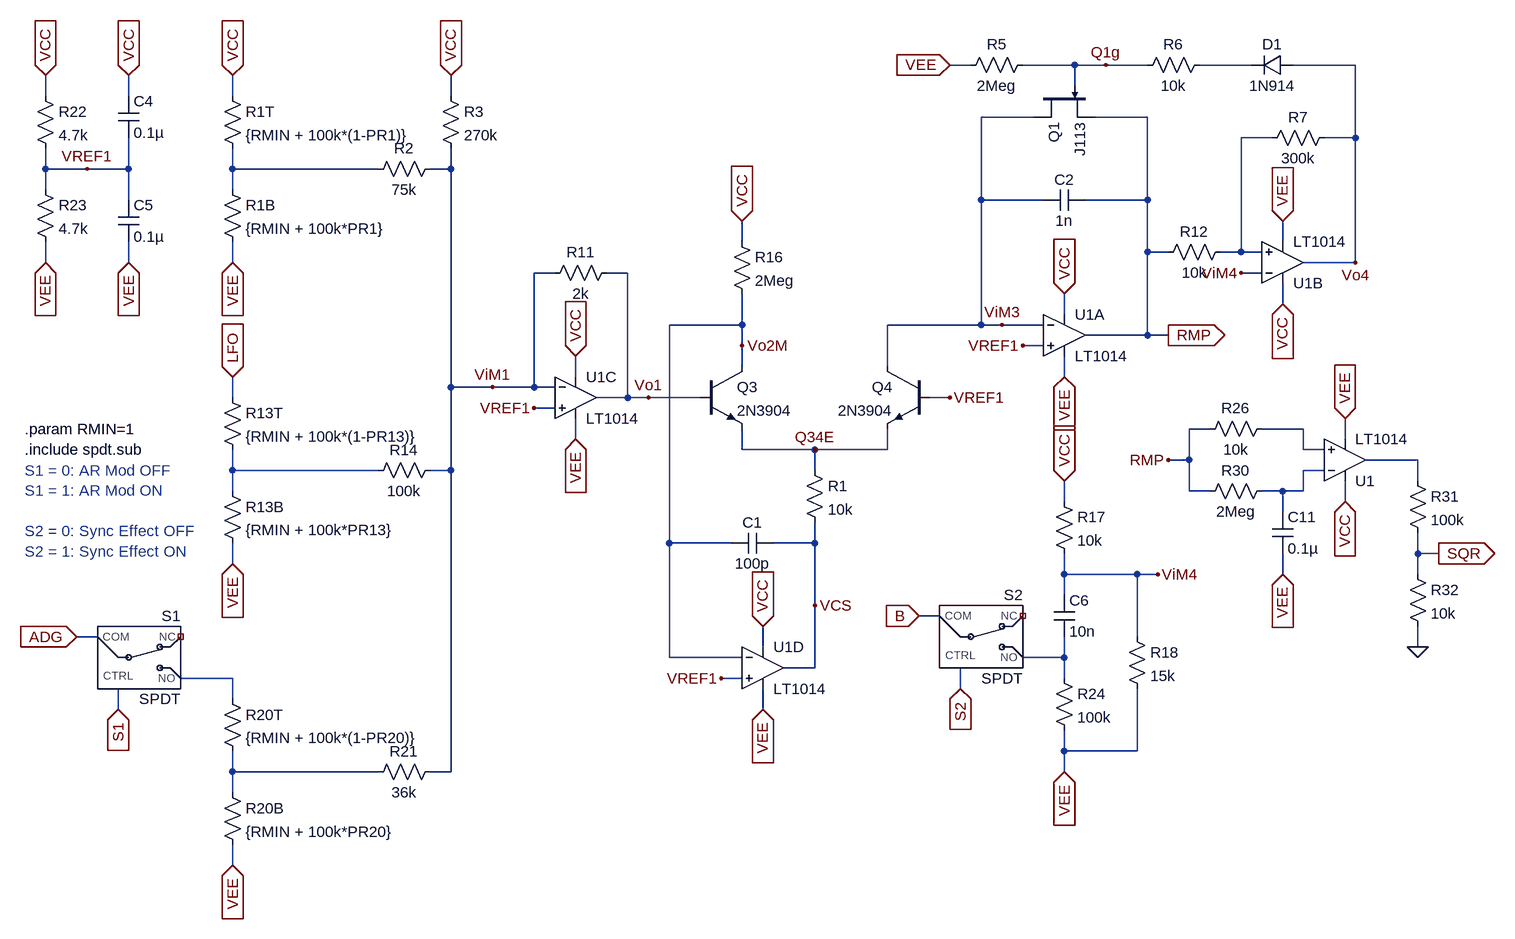
[diagram p0: schematic VCO.asc]
VCO.asc, the LTspice schematic file:
Version 4.1
SHEET 1 2252 1144
WIRE 1248 -336 1216 -336
WIRE 1408 -336 1328 -336
WIRE 1456 -336 1408 -336
WIRE 1520 -336 1456 -336
WIRE 1680 -336 1600 -336
WIRE 1840 -336 1744 -336
WIRE 1408 -304 1408 -336
WIRE -176 -288 -176 -320
WIRE -48 -288 -48 -320
WIRE 112 -288 112 -320
WIRE 448 -288 448 -320
WIRE 1344 -256 1264 -256
WIRE 1520 -256 1440 -256
WIRE 1712 -224 1664 -224
WIRE 1840 -224 1840 -336
WIRE 1840 -224 1792 -224
WIRE -176 -176 -176 -208
WIRE -112 -176 -176 -176
WIRE -48 -176 -48 -224
WIRE -48 -176 -112 -176
WIRE 112 -176 112 -208
WIRE 336 -176 112 -176
WIRE 448 -176 448 -208
WIRE 448 -176 416 -176
WIRE -176 -144 -176 -176
WIRE 112 -144 112 -176
WIRE -48 -128 -48 -176
WIRE 1264 -128 1264 -256
WIRE 1360 -128 1264 -128
WIRE 1520 -128 1520 -256
WIRE 1520 -128 1424 -128
WIRE 896 -64 896 -96
WIRE 1728 -64 1728 -96
WIRE 1520 -48 1520 -128
WIRE 1552 -48 1520 -48
WIRE 1664 -48 1664 -224
WIRE 1664 -48 1632 -48
WIRE 1696 -48 1664 -48
WIRE -176 -32 -176 -64
WIRE -48 -32 -48 -64
WIRE 112 -32 112 -64
WIRE 1840 -32 1840 -224
WIRE 1840 -32 1760 -32
WIRE 608 -16 576 -16
WIRE 720 -16 688 -16
WIRE 1696 -16 1664 -16
WIRE 1728 32 1728 0
WIRE 1392 48 1392 16
WIRE 896 64 896 16
WIRE 896 64 784 64
WIRE 1264 64 1264 -128
WIRE 1264 64 1120 64
WIRE 1296 64 1264 64
WIRE 1360 64 1296 64
WIRE 1520 80 1520 -48
WIRE 1520 80 1424 80
WIRE 1552 80 1520 80
WIRE 896 96 896 64
WIRE 1360 96 1328 96
WIRE 896 128 896 96
WIRE 1120 128 1120 64
WIRE 640 144 640 112
WIRE 1392 144 1392 112
WIRE 448 160 448 -176
WIRE 512 160 448 160
WIRE 576 160 576 -16
WIRE 576 160 512 160
WIRE 608 160 576 160
WIRE 112 176 112 144
WIRE 720 176 720 -16
WIRE 720 176 672 176
WIRE 752 176 720 176
WIRE 832 176 752 176
WIRE 1216 176 1184 176
WIRE 608 192 576 192
WIRE 1616 224 1584 224
WIRE 1760 224 1696 224
WIRE 640 240 640 208
WIRE 1824 240 1824 208
WIRE 896 256 896 224
WIRE 1008 256 896 256
WIRE 1120 256 1120 224
WIRE 1120 256 1008 256
WIRE 1760 256 1760 224
WIRE 1792 256 1760 256
WIRE 1584 272 1584 224
WIRE 1584 272 1552 272
WIRE 1936 272 1856 272
WIRE 112 288 112 256
WIRE 336 288 112 288
WIRE 448 288 448 160
WIRE 448 288 416 288
WIRE 1008 288 1008 256
WIRE 1792 288 1760 288
WIRE 1936 304 1936 272
WIRE 112 320 112 288
WIRE 1584 320 1584 272
WIRE 1616 320 1584 320
WIRE 1728 320 1696 320
WIRE 1760 320 1760 288
WIRE 1760 320 1728 320
WIRE 1392 336 1392 304
WIRE 1824 336 1824 304
WIRE 1728 352 1728 320
WIRE 784 400 784 64
WIRE 880 400 784 400
WIRE 1008 400 1008 368
WIRE 1008 400 944 400
WIRE 1936 416 1936 384
WIRE 1968 416 1936 416
WIRE 112 432 112 400
WIRE 1392 448 1392 416
WIRE 1504 448 1392 448
WIRE 1536 448 1504 448
WIRE 1728 448 1728 416
WIRE 1936 448 1936 416
WIRE 1392 480 1392 448
WIRE 1008 496 1008 400
WIRE 1200 512 1168 512
WIRE -96 544 -128 544
WIRE 1504 544 1504 448
WIRE 928 560 928 528
WIRE 1936 560 1936 528
WIRE 784 576 784 400
WIRE 896 576 784 576
WIRE 1392 576 1392 544
WIRE 1392 576 1328 576
WIRE 1008 592 1008 496
WIRE 1008 592 960 592
WIRE 112 608 32 608
WIRE 896 608 864 608
WIRE 1392 608 1392 576
WIRE 1232 624 1232 592
WIRE 112 640 112 608
WIRE -64 656 -64 624
WIRE 928 656 928 624
WIRE 1392 720 1392 688
WIRE 1504 720 1504 624
WIRE 1504 720 1392 720
WIRE 112 752 112 720
WIRE 336 752 112 752
WIRE 448 752 448 288
WIRE 448 752 416 752
WIRE 1392 752 1392 720
WIRE 112 784 112 752
WIRE 112 896 112 864
FLAG 112 -32 VEE
IOPIN 112 -32 In
FLAG 112 -320 VCC
IOPIN 112 -320 In
FLAG 112 432 VEE
IOPIN 112 432 In
FLAG 112 144 LFO
IOPIN 112 144 In
FLAG 112 896 VEE
IOPIN 112 896 In
FLAG -128 544 ADG
IOPIN -128 544 In
FLAG -64 656 S1
IOPIN -64 656 In
FLAG 640 112 VCC
IOPIN 640 112 In
FLAG 640 240 VEE
IOPIN 640 240 In
FLAG 448 -320 VCC
IOPIN 448 -320 In
FLAG 576 192 VREF1
FLAG 896 -96 VCC
IOPIN 896 -96 In
FLAG 928 528 VCC
IOPIN 928 528 In
FLAG 928 656 VEE
IOPIN 928 656 In
FLAG 864 608 VREF1
FLAG 1216 176 VREF1
FLAG 1392 16 VCC
IOPIN 1392 16 In
FLAG 1392 144 VEE
IOPIN 1392 144 In
FLAG 1328 96 VREF1
FLAG 1216 -336 VEE
IOPIN 1216 -336 In
FLAG 1728 -96 VEE
IOPIN 1728 -96 In
FLAG 1728 32 VCC
IOPIN 1728 32 In
FLAG 1552 80 RMP
IOPIN 1552 80 Out
FLAG 1392 752 VEE
IOPIN 1392 752 In
FLAG 1392 304 VCC
IOPIN 1392 304 In
FLAG 1168 512 B
IOPIN 1168 512 In
FLAG 1232 624 S2
IOPIN 1232 624 In
FLAG 1824 208 VEE
IOPIN 1824 208 In
FLAG 1824 336 VCC
IOPIN 1824 336 In
FLAG 1728 448 VEE
IOPIN 1728 448 In
FLAG 1936 560 0
FLAG 1968 416 SQR
IOPIN 1968 416 Out
FLAG 1664 -16 ViM4
FLAG 1536 448 ViM4
FLAG 1552 272 RMP
FLAG 752 176 Vo1
FLAG 1296 64 ViM3
FLAG -176 -32 VEE
IOPIN -176 -32 In
FLAG -176 -320 VCC
IOPIN -176 -320 In
FLAG -48 -32 VEE
IOPIN -48 -32 In
FLAG -48 -320 VCC
IOPIN -48 -320 In
FLAG -112 -176 VREF1
FLAG 1840 -32 Vo4
FLAG 1456 -336 Q1g
FLAG 896 96 Vo2M
FLAG 1008 256 Q34E
FLAG 1008 496 VCS
FLAG 512 160 ViM1
SYMBOL npn 832 128 R0
SYMATTR InstName Q3
SYMATTR Value 2N3904
SYMBOL njf 1344 -304 M90
SYMATTR InstName Q1
SYMATTR Value J113
SYMBOL diode 1744 -320 M270
WINDOW 0 32 32 VTop 2
WINDOW 3 0 32 VBottom 2
SYMATTR InstName D1
SYMATTR Value 1N914
SYMBOL res 96 -304 R0
SYMATTR InstName R1T
SYMATTR Value {RMIN + 100k*(1-PR1)}
SYMBOL res 96 -160 R0
SYMATTR InstName R1B
SYMATTR Value {RMIN + 100k*PR1}
SYMBOL res 432 -192 R90
WINDOW 0 0 56 VBottom 2
WINDOW 3 32 56 VTop 2
SYMATTR InstName R2
SYMATTR Value 75k
SYMBOL res 96 160 R0
SYMATTR InstName R13T
SYMATTR Value {RMIN + 100k*(1-PR13)}
SYMBOL res 96 304 R0
SYMATTR InstName R13B
SYMATTR Value {RMIN + 100k*PR13}
SYMBOL res 432 272 R90
WINDOW 0 0 56 VBottom 2
WINDOW 3 32 56 VTop 2
SYMATTR InstName R14
SYMATTR Value 100k
SYMBOL res 96 624 R0
SYMATTR InstName R20T
SYMATTR Value {RMIN + 100k*(1-PR20)}
SYMBOL res 96 768 R0
SYMATTR InstName R20B
SYMATTR Value {RMIN + 100k*PR20}
SYMBOL res 432 736 R90
WINDOW 0 0 56 VBottom 2
WINDOW 3 32 56 VTop 2
SYMATTR InstName R21
SYMATTR Value 36k
SYMBOL spdt -64 576 M0
SYMATTR InstName S1
SYMBOL OpAmps\\LT1014 640 112 R0
SYMATTR InstName U1C
SYMBOL res 432 -304 R0
SYMATTR InstName R3
SYMATTR Value 270k
SYMBOL res 704 -32 R90
WINDOW 0 0 56 VBottom 2
WINDOW 3 32 56 VTop 2
SYMATTR InstName R11
SYMATTR Value 2k
SYMBOL res 880 -80 R0
SYMATTR InstName R16
SYMATTR Value 2Meg
SYMBOL npn 1184 128 M0
SYMATTR InstName Q4
SYMATTR Value 2N3904
SYMBOL res 992 272 R0
SYMATTR InstName R1
SYMATTR Value 10k
SYMBOL OpAmps\\LT1014 928 528 R0
SYMATTR InstName U1D
SYMBOL cap 944 384 R90
WINDOW 0 0 32 VBottom 2
WINDOW 3 32 32 VTop 2
SYMATTR InstName C1
SYMATTR Value 100p
SYMATTR SpiceLine Rser=0.1
SYMBOL OpAmps\\LT1014 1392 16 R0
SYMATTR InstName U1A
SYMBOL cap 1424 -144 R90
WINDOW 0 0 32 VBottom 2
WINDOW 3 32 32 VTop 2
SYMATTR InstName C2
SYMATTR Value 1n
SYMATTR SpiceLine Rser=0.1
SYMBOL res 1232 -320 R270
WINDOW 0 32 56 VTop 2
WINDOW 3 0 56 VBottom 2
SYMATTR InstName R5
SYMATTR Value 2Meg
SYMBOL res 1616 -352 R90
WINDOW 0 0 56 VBottom 2
WINDOW 3 32 56 VTop 2
SYMATTR InstName R6
SYMATTR Value 10k
SYMBOL OpAmps\\LT1014 1728 32 M180
SYMATTR InstName U1B
SYMBOL res 1648 -64 R90
WINDOW 0 0 56 VBottom 2
WINDOW 3 32 56 VTop 2
SYMATTR InstName R12
SYMATTR Value 10k
SYMBOL res 1808 -240 R90
WINDOW 0 0 56 VBottom 2
WINDOW 3 32 56 VTop 2
SYMATTR InstName R7
SYMATTR Value 300k
SYMBOL res 1376 320 R0
SYMATTR InstName R17
SYMATTR Value 10k
SYMBOL res 1376 592 R0
SYMATTR InstName R24
SYMATTR Value 100k
SYMBOL cap 1376 480 R0
SYMATTR InstName C6
SYMATTR Value 10n
SYMATTR SpiceLine Rser=0.1
SYMBOL spdt 1232 544 M0
SYMATTR InstName S2
SYMBOL res 1488 528 R0
SYMATTR InstName R18
SYMATTR Value 15k
SYMBOL OpAmps\\LT1014 1824 336 M180
SYMATTR InstName U1
SYMBOL res 1712 208 R90
WINDOW 0 0 56 VBottom 2
WINDOW 3 32 56 VTop 2
SYMATTR InstName R26
SYMATTR Value 10k
SYMBOL res 1712 304 R90
WINDOW 0 0 56 VBottom 2
WINDOW 3 32 56 VTop 2
SYMATTR InstName R30
SYMATTR Value 2Meg
SYMBOL cap 1712 352 R0
SYMATTR InstName C11
SYMATTR Value 0.1µ
SYMATTR SpiceLine Rser=0.1
SYMBOL res 1920 288 R0
SYMATTR InstName R31
SYMATTR Value 100k
SYMBOL res 1920 432 R0
SYMATTR InstName R32
SYMATTR Value 10k
SYMBOL res -192 -304 R0
SYMATTR InstName R22
SYMATTR Value 4.7k
SYMBOL res -192 -160 R0
SYMATTR InstName R23
SYMATTR Value 4.7k
SYMBOL cap -64 -288 R0
SYMATTR InstName C4
SYMATTR Value 0.1µ
SYMATTR SpiceLine Rser=0.1
SYMBOL cap -64 -128 R0
SYMATTR InstName C5
SYMATTR Value 0.1µ
TEXT -208 288 Left 2 ;S1 = 0: AR Mod OFF\nS1 = 1: AR Mod ON\n \nS2 = 0: Sync Effect OFF\nS2 = 1: Sync Effect ON
TEXT -208 256 Left 2 !.include spdt.sub
TEXT -208 224 Left 2 !.param RMIN=1

The netlist it stands for:
* VCO.asc
Q3 Vo2M Vo1 Q34E 0 2N3904
J§Q1 ViM3 Q1g RMP J113
D1 Vo4 N001 1N914
R1T VCC N003 {RMIN + 100k*(1-PR1)}
R1B N003 VEE {RMIN + 100k*PR1}
R2 ViM1 N003 75k
R13T LFO N006 {RMIN + 100k*(1-PR13)}
R13B N006 VEE {RMIN + 100k*PR13}
R14 ViM1 N006 100k
R20T N009 N010 {RMIN + 100k*(1-PR20)}
R20B N010 VEE {RMIN + 100k*PR20}
R21 ViM1 N010 36k
X§S1 ADG N009 NC_01 S1 SPDT  ; pins COM NO NC CTRL
X§U1C VREF1 ViM1 VCC VEE Vo1 LT1014  ; pins In+ In- V+ V- OUT
R3 VCC ViM1 270k
R11 Vo1 ViM1 2k
R16 VCC Vo2M 2Meg
Q4 ViM3 VREF1 Q34E 0 2N3904
R1 Q34E VCS 10k
X§U1D VREF1 Vo2M VCC VEE VCS LT1014  ; pins In+ In- V+ V- OUT
C1 VCS Vo2M 100p Rser=0.1
X§U1A VREF1 ViM3 VCC VEE RMP LT1014  ; pins In+ In- V+ V- OUT
C2 RMP ViM3 1n Rser=0.1
R5 VEE Q1g 2Meg
R6 N001 Q1g 10k
X§U1B N002 ViM4 VCC VEE Vo4 LT1014  ; pins In+ In- V+ V- OUT
R12 N002 RMP 10k
R7 Vo4 N002 300k
R17 VCC ViM4 10k
R24 N008 VEE 100k
C6 ViM4 N008 10n Rser=0.1
X§S2 B N008 NC_02 S2 SPDT  ; pins COM NO NC CTRL
R18 ViM4 VEE 15k
X§U1 N004 N007 VCC VEE N005 LT1014  ; pins In+ In- V+ V- OUT
R26 N004 RMP 10k
R30 N007 RMP 2Meg
C11 N007 VEE 0.1µ Rser=0.1
R31 N005 SQR 100k
R32 SQR 0 10k
R22 VCC VREF1 4.7k
R23 VREF1 VEE 4.7k
C4 VCC VREF1 0.1µ Rser=0.1
C5 VREF1 VEE 0.1µ
.model D D
.lib standard.dio
.model NPN NPN
.model PNP PNP
.lib standard.bjt
.model NJF NJF
.model PJF PJF
.lib standard.jft
* S1 = 0: AR Mod OFF
* S1 = 1: AR Mod ON
* S2 = 0: Sync Effect OFF
* S2 = 1: Sync Effect ON
.include spdt.sub
.param RMIN=1
.backanno
.end